# Altium schematic sheet PSU.SchDoc
size A
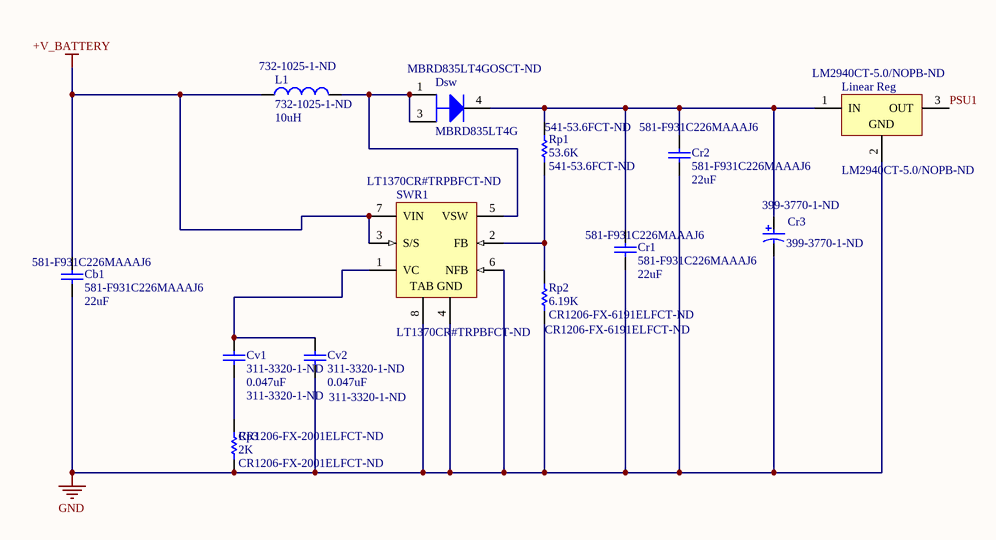
[diagram p0: PSU.SchDoc]

## Parts
Cb1  581-F931C226MAAAJ6  value 22uF  [C1206]
Cr1  581-F931C226MAAAJ6  value 22uF  [C1206]
Cr2  581-F931C226MAAAJ6  value 22uF  [C1206]
Cr3  399-3770-1-ND  [KEMT-T491-D_L]
Cv1  311-3320-1-ND  value 0.047uF  [C1206]
Cv2  311-3320-1-ND  value 0.047uF  [C1206]
Dsw  MBRD835LT4G  Supplier Part Number 1: MBRD835LT4GOSCT-ND  [ONSC-DPAK-3-369C-01_V]
L1  732-1025-1-ND  value 10uH  [2029]
Linear_Reg  LM2940CT-5.0/NOPB-ND  [NDE0003A]
Rp1  541-53.6FCT-ND  value 53.6K  [C1206]
Rp2  CR1206-FX-6191ELFCT-ND  value 6.19K  [C1206]
Rp3  CR1206-FX-2001ELFCT-ND  value 2K  [C1206]
SWR1  LT1370CR#TRPBFCT-ND  [LT-R-7_L]

## Nets
+V_BATTERY: Cb1.2 L1.1 SWR1.3(S/S) SWR1.7(VIN)
GND: Cb1.1 Cr1.1 Cr2.1 Cr3.2 Cv2.2 Linear_Reg.2(GND) Rp2.1 Rp3.1 SWR1.4(GND) SWR1.6(NFB) SWR1.8(TAB)
PSU1: Linear_Reg.3(OUT)
NetCr1_2: Cr1.2 Cr2.2 Cr3.1 Dsw.4(K) Linear_Reg.1(IN) Rp1.2
NetCv1_1: Cv1.1 Cv2.1 SWR1.1(VC)
NetCv1_2: Cv1.2 Rp3.2
NetDsw_1: Dsw.1(A) Dsw.3(A) L1.2 SWR1.5(VSW)
NetRp1_1: Rp1.1 Rp2.2 SWR1.2(FB)

## Library data of the parts
Cb1 Cr1 Cr2 = Cap: Cap Tant Solid 22uF 16V A CASE 20% (3.2 X 1.6 X 1.6mm) Inward L SMD 3216-18 3 Ohm 125C Automotive T/R, Mouser; Manufacturer: Kyocera AVX; Published: 8-Jun-2000; LatestRevisionDate: 17-Jul-2002; LatestRevisionNote: Re-released for DXP Platform.; PackageReference: RAD-0.3; Publisher: Altium Limited; PackageDescription: Radial Cap, Thru-Hole; 2 Leads; 0.3 in Pin Spacing; Supplier 1: Mouser; Supplier Part Number 1: 581-F931C226MAAAJ6; Manufacturer Part Number: F931C226MAAAJ6; RoHS: No; Stock 1: 5204; Pricing 1: 1=0.64000, 10=0.45200, 100=0.28600, 500=0.22000, 1000=0.18700, 2000=0.14300 (USD)
Cr3 = CMP-2000-07541-1: Tantalum Surface Mount Capacitor, 100 uF, +/- 10%, 16 V, -55 to 125 degC, 2917 (7343 Metric), RoHS, Tape and Reel, Digi-key; Manufacturer: Kemet; Manufacturer Part Number: T491D107K016AT; ESR (Equivalent Series Resistance): 700mOhm; Dissipation Factor: 8%; Voltage Rating (DC): 16V; Case\/Package: Molded; Polarity: Polar; Capacitance: 100uF; Life (Hours): 2000Hour; Leakage Current: 16uA; Ripple Current: 463mA; RoHSCompliant: true; Datasheet Version: 07/2017; Case Code (Imperial): 2917; Width: 4.3mm; Height: 2.8mm; Min Operating Temperature: -55degC; Length: 7.3mm; Package Reference: T491-D; Dielectric Material: Tantalum; Packaging: TapeandReel; Max Operating Temperature: 125degC; Package Description: 2-Pin Surface Mount Device, Body 7.3 x 4.3 mm; Package Quantity: 1; Lead Free: LeadFree; Case Code (Metric): 7343; Voltage: 16V; Voltage Rating: 16V; Tolerance: 10%; Weight: 0.023634oz; Termination: SMD/SMT; Lead Pitch: 3.6mm; Manufacturer URL: http://www.kemet.com/; Datasheet URL: http://www.kemet.com/Lists/ProductCatalog/Attachments/254/KEM_T2005_T491.pdf; Radiation Hardening: No; Mount: PCB; Height - Seated (Max): 0.122inch; Mounting Technology: SurfaceMount; Depth: 4.3mm; REACH SVHC: NoSVHC; Supplier 1: Digi-Key; Supplier Part Number 1: 399-3770-1-ND; RoHS: Yes; Category: Tantalum Capacitors; Stock 1: 119781; Pricing 1: 1=1.30000, 10=1.02600, 100=0.76930 (USD); Case/Package: Molded; Features: General Purpose; ComponentLink1URL: https://datasheet.ciiva.com/20171/458379-da-en-01-20171921.pdf?src-supplier=Rapid+Electronics; ComponentLink1Description: https://datasheet.ciiva.com/20171/458379-da-en-01-20171921.pdf?src-supplier=Rapid+Electronics; ComponentLink2URL: https://datasheet.ciiva.com/27052/1574225-27052588.pdf?src-supplier=Jameco; ComponentLink2Description: https://datasheet.ciiva.com/27052/1574225-27052588.pdf?src-supplier=Jameco; ComponentLink3URL: https://datasheet.ciiva.com/5934/1732757-5934631.pdf?src-supplier=Farnell; ComponentLink3Description: https://datasheet.ciiva.com/5934/1732757-5934631.pdf?src-supplier=Farnell; ComponentLink4URL: https://datasheet.ciiva.com/26341/458379-da-01-en-kondensator-100uf-7343-10pr-16v-85c-26341618.pdf?src-supplier=Conrad; ComponentLink4Description: https://datasheet.ciiva.com/26341/458379-da-01-en-kondensator-100uf-7343-10pr-16v-85c-26341618.pdf?src-supplier=Conrad; ComponentLink5URL: https://datasheet.ciiva.com/260/kem-t2005-t491-260262.pdf?src-supplier=Digi-Key; ComponentLink5Description: https://datasheet.ciiva.com/260/kem-t2005-t491-260262.pdf?src-supplier=Digi-Key; ComponentLink6URL: https://datasheet.ciiva.com/260/kem-t2005-t491-260263.pdf?src-supplier=Digi-Key; ComponentLink6Description: https://datasheet.ciiva.com/260/kem-t2005-t491-260263.pdf?src-supplier=Digi-Key; ComponentLink7URL: https://datasheet.ciiva.com/41657/1854511-41657335.pdf?src-supplier=Farnell; ComponentLink7Description: https://datasheet.ciiva.com/41657/1854511-41657335.pdf?src-supplier=Farnell; ComponentLink8URL: https://datasheet.ciiva.com/260/kem-t2005-t491-260264.pdf?src-supplier=Digi-Key; ComponentLink8Description: https://datasheet.ciiva.com/260/kem-t2005-t491-260264.pdf?src-supplier=Digi-Key; ComponentLink9URL: https://datasheet.ciiva.com/14595/70095774-14595116.pdf?src-supplier=Allied+Electronics; ComponentLink9Description: https://datasheet.ciiva.com/14595/70095774-14595116.pdf?src-supplier=Allied+Electronics; ComponentLink10URL: https://datasheet.ciiva.com/7696/1854511-7696350.pdf?src-supplier=Element14; ComponentLink10Description: https://datasheet.ciiva.com/7696/1854511-7696350.pdf?src-supplier=Element14; ComponentLink11URL: https://datasheet.ciiva.com/14588/70095774-14588350.pdf?src-supplier=Allied+Electronics; ComponentLink11Description: https://datasheet.ciiva.com/14588/70095774-14588350.pdf?src-supplier=Allied+Electronics; ComponentLink12URL: https://datasheet.ciiva.com/7696/1854511-7696351.pdf?src-supplier=Element14; ComponentLink12Description: https://datasheet.ciiva.com/7696/1854511-7696351.pdf?src-supplier=Element14
Cv1 Cv2 = Cap: CAP CER 0.47UF 4V X5R 0201, Digi-key; Manufacturer: Yageo; Manufacturer Part Number: CC0201MRX5R4BB474; Capacitance: 470nF; Tolerance: 20%; Published: 8-Jun-2000; LatestRevisionDate: 17-Jul-2002; LatestRevisionNote: Re-released for DXP Platform.; PackageReference: RAD-0.3; Publisher: Altium Limited; PackageDescription: Radial Cap, Thru-Hole; 2 Leads; 0.3 in Pin Spacing; Supplier 1: Digi-Key; Supplier Part Number 1: 311-3320-1-ND; RoHS: Yes; Category: Ceramic Capacitors; Stock 1: 31395; Pricing 1: 1=0.10000, 10=0.07100, 100=0.03150, 500=0.02252, 1000=0.01770, 2500=0.01609, 5000=0.01480 (USD); Mount: Surface Mount; Case/Package: 0201; Min Operating Temperature: -55°C; Max Operating Temperature: 85°C; Packaging: Tape and Reel; Voltage Rating: 4V; Length: 0.024inch; Width: 0.012inch; Thickness: 0.013inch; ComponentLink1URL: http://www.yageo.com/documents/recent/UPY-GPHC_X5R_4V-to-50V_23.pdf?src-supplier=Digi-Key; ComponentLink1Description: http://www.yageo.com/documents/recent/UPY-GPHC_X5R_4V-to-50V_23.pdf?src-supplier=Digi-Key; ComponentLink2URL: http://www.yageo.com/documents/recent/UPY-GPHC_X5R_4V-to-50V_25.pdf?src-supplier=Digi-Key; ComponentLink2Description: http://www.yageo.com/documents/recent/UPY-GPHC_X5R_4V-to-50V_25.pdf?src-supplier=Digi-Key
Dsw = CMP-1055-00173-1: SWITCHMODE(TM) Power Rectifier, 3-Pin DPAK, Pb-Free, Tape and Reel, Digi-key; Manufacturer: On Semiconductor; IFSM Max (A): 75; Configuration: Single; ComponentLink3URL: http://www.onsemi.cn/pub_link/Collateral/369C.PDF; ComponentLink2URL: http://www.onsemi.cn/pub_link/Collateral/MBRD835L-D.PDF; RoHS: TRUE; PackageVersion: Rev. E, 02/2014; Mounting Technology: Surface Mount; PackageDescription: 3-Pin Flange Mount, Body 6.54 x 6.095 mm, Pitch 2.29 mm; PartNumber: MBRD835LT4G; ComponentLink1URL: http://www.onsemi.com/; PackageReference: DPAK-3-369C-01; Packing: Tape and Reel; ComponentLink1Description: Manufacturer URL; ComponentLink2Description: Datasheet; DatasheetVersion: Rev. 11; ComponentLink3Description: Package Specification; Supplier 1: Digi-Key
L1 = Inductor: Inductor, SMD 10 uH 1.3 A ±30%, 744042100, Würth Elektronik, Digi-key; Manufacturer: Wurth Electronics; Code_IEC: 1005; Core Material: Ferrite; DC Resistance (DCR): 150mR; Max DC Current: 1.3A; Self Resonant Frequency: 45MHz; Shielding: Shielded; Test Frequency: 100kHz; Saturation Current: 1A; Published: 8-Jun-2000; LatestRevisionDate: 29-May-2009; LatestRevisionNote: IPC-7351 Footprint Added.; PackageReference: 0402-A; Publisher: Altium Limited; PackageDescription: Chip Inductor; Code_JEITA: 0402; Supplier 1: Digi-Key; Supplier Part Number 1: 732-1025-1-ND; Manufacturer Part Number: 744042100; RoHS: Yes; Category: Fixed Inductors; Stock 1: 16164; Pricing 1: 1=1.43000, 10=1.38900, 50=1.21500, 100=1.11100 (USD); Mount: Surface Mount; Case/Package: 1919; Number of Pins: 2; Weight: 0.00582oz; Case Code (Imperial): 1919; Case Code (Metric): 4848; Min Operating Temperature: -40°C; Max Operating Temperature: 125°C; Termination: SMD/SMT; Packaging: Tape and Reel; Inductance: 10uH; Tolerance: 30%; Package Quantity: 800; Inductance Tolerance: 30%; Current Rating: 1.3A; RMS Current (Irms): 1.3A; Composition: Wirewound; Series Resistance: 150mR; Length: 4.8mm; Height: 1.8mm; Width: 4.8mm; Depth: 4.8mm; Height - Seated (Max): 0.079inch; REACH SVHC: Unknown; Lead Free: Lead Free; ComponentLink1URL: https://datasheet.ciiva.com/13320/744042100-88981-13320858.pdf?src-supplier=Mouser; ComponentLink1Description: https://datasheet.ciiva.com/13320/744042100-88981-13320858.pdf?src-supplier=Mouser; ComponentLink2URL: https://datasheet.ciiva.com/11800/0900766b8079f7c1-11800146.pdf?src-supplier=RSComponents; ComponentLink2Description: https://datasheet.ciiva.com/11800/0900766b8079f7c1-11800146.pdf?src-supplier=RSComponents; ComponentLink3URL: https://datasheet.ciiva.com/22702/744042100-22702643.pdf?src-supplier=Element14; ComponentLink3Description: https://datasheet.ciiva.com/22702/744042100-22702643.pdf?src-supplier=Element14; ComponentLink4URL: https://datasheet.ciiva.com/1050/744042100-1050948.pdf?src-supplier=Digi-Key; ComponentLink4Description: https://datasheet.ciiva.com/1050/744042100-1050948.pdf?src-supplier=Digi-Key; ComponentLink5URL: https://datasheet.ciiva.com/1050/744042100-1050950.pdf?src-supplier=Digi-Key; ComponentLink5Description: https://datasheet.ciiva.com/1050/744042100-1050950.pdf?src-supplier=Digi-Key; ComponentLink6URL: https://datasheet.ciiva.com/1050/744042100-1050949.pdf?src-supplier=Digi-Key; ComponentLink6Description: https://datasheet.ciiva.com/1050/744042100-1050949.pdf?src-supplier=Digi-Key; ComponentLink7URL: https://datasheet.ciiva.com/7754/744042100-7754411.pdf?src-supplier=Element14; ComponentLink7Description: https://datasheet.ciiva.com/7754/744042100-7754411.pdf?src-supplier=Element14
Linear_Reg = CMP-0062-02545-3: 1A Low Dropout Regulator, 3-pin TO-220, Pb-Free, Digi-key; Manufacturer: Texas Instruments; CompType: LDO IC; PowerWise: N; PackageTopMarking: NSUZXYTTE#*LM2940CT*-5.0 P+; RoHS: Y; ComponentLink1URL: http://www.ti.com/general/docs/lit/getliterature.tsp?genericPartNumber=LM2940C&fileType=pdf; PinCount: 3; ComponentLink1Description: Datasheet URL; PackageReference: NDE0003A; PackageDescription: TO-220, Molded, 3 Lead, Straight; Supplier 1: Digi-Key; Supplier Part Number 1: LM2940CT-5.0/NOPB-ND
Rp1 = Res1: Res Thick Film 1206 53.6 Ohm 1% 0.25W(1/4W) ±100ppm/C Molded SMD Automotive Paper T/R, Digi-key; Manufacturer: Vishay; Manufacturer Part Number: CRCW120653R6FKEA; Resistance: 53.6R; Power Rating: 250mW; Voltage Rating (DC): 200V; Temperature Coefficient: 100ppm/°C; Published: 8-Jun-2000; LatestRevisionDate: 17-Jul-2002; LatestRevisionNote: Re-released for DXP Platform.; PackageReference: AXIAL-0.3; Publisher: Altium Limited; PackageDescription: Axial Device, Thru-Hole; 2 Leads; 0.3 in Pin Spacing; Supplier 1: Digi-Key; Supplier Part Number 1: 541-53.6FCT-ND; RoHS: Yes; Category: Chip SMD Resistors; Stock 1: 787; Pricing 1: 1=0.10000, 10=0.07600, 100=0.02930, 1000=0.01287, 2500=0.01112 (USD); Case/Package: 1206; Number of Pins: 2; Weight: 0.000353oz; Contact Plating: Tin; Case Code (Metric): 3216; Case Code (Imperial): 1206; Min Operating Temperature: -55°C; Max Operating Temperature: 155°C; Package Quantity: 10; Packaging: Tape and Reel; Termination: SMD/SMT; Tolerance: 1%; Number of Terminations: 2; Voltage Rating: 200V; Composition: Thick Film; Max Power Dissipation: 250mW; Military Standard: Not; Features: Automotive AEC-Q200; Length: 3.2mm; Height: 0.024inch; Depth: 1.6mm; Width: 0.063inch; Radiation Hardening: No; REACH SVHC: Unknown; Lead Free: Lead Free; ComponentLink1URL: https://datasheet.ciiva.com/2497/dcrcwe3-2497248.pdf?src-supplier=Digi-Key; ComponentLink1Description: https://datasheet.ciiva.com/2497/dcrcwe3-2497248.pdf?src-supplier=Digi-Key; ComponentLink2URL: https://datasheet.ciiva.com/9000/dcrcwe3-9000149.pdf?src-supplier=Avnet; ComponentLink2Description: https://datasheet.ciiva.com/9000/dcrcwe3-9000149.pdf?src-supplier=Avnet; ComponentLink3URL: https://datasheet.ciiva.com/5543/dcrcwe3-109170-5543196.pdf?src-supplier=Mouser; ComponentLink3Description: https://datasheet.ciiva.com/5543/dcrcwe3-109170-5543196.pdf?src-supplier=Mouser; ComponentLink4URL: https://datasheet.ciiva.com/22699/1697337-22699228.pdf?src-supplier=Element14; ComponentLink4Description: https://datasheet.ciiva.com/22699/1697337-22699228.pdf?src-supplier=Element14; ComponentLink5URL: https://datasheet.ciiva.com/7732/1697337-7732205.pdf?src-supplier=Element14; ComponentLink5Description: https://datasheet.ciiva.com/7732/1697337-7732205.pdf?src-supplier=Element14; ComponentLink6URL: https://datasheet.ciiva.com/2497/dcrcwe3-2497246.pdf?src-supplier=Digi-Key; ComponentLink6Description: https://datasheet.ciiva.com/2497/dcrcwe3-2497246.pdf?src-supplier=Digi-Key; ComponentLink7URL: https://datasheet.ciiva.com/7732/1697337-7732206.pdf?src-supplier=Element14; ComponentLink7Description: https://datasheet.ciiva.com/7732/1697337-7732206.pdf?src-supplier=Element14; ComponentLink8URL: https://datasheet.ciiva.com/2497/dcrcwe3-2497247.pdf?src-supplier=Digi-Key; ComponentLink8Description: https://datasheet.ciiva.com/2497/dcrcwe3-2497247.pdf?src-supplier=Digi-Key
Rp2 = Res1: Thick Film Resistors 6.19K 1%,Digi-key; Manufacturer: Bourns; Max Power Dissipation: 250mW; Temperature Coefficient: 100ppm/°C; Resistance: 6.19kR; Voltage Rating: 200V; Published: 8-Jun-2000; LatestRevisionDate: 17-Jul-2002; LatestRevisionNote: Re-released for DXP Platform.; PackageReference: AXIAL-0.3; Publisher: Altium Limited; PackageDescription: Axial Device, Thru-Hole; 2 Leads; 0.3 in Pin Spacing; Supplier 1: Digi-Key; Supplier Part Number 1: CR1206-FX-6191ELFCT-ND; Manufacturer Part Number: CR1206-FX-6191ELF; RoHS: Yes; Category: Chip SMD Resistors; Stock 1: 19832; Pricing 1: 1=0.11000, 10=0.09400, 100=0.03630, 1000=0.01597, 2500=0.01380 (USD); Mount: Surface Mount; Case/Package: 1206; Contact Plating: Tin; Case Code (Imperial): 1206; Case Code (Metric): 3216; Min Operating Temperature: -55°C; Max Operating Temperature: 155°C; Termination: SMD/SMT; Number of Terminations: 2; Military Standard: Not; Composition: Thick Film; Tolerance: 1%; Power Rating: 250mW; Packaging: Tape and Reel; Package Quantity: 5000; Length: 3.2mm; Height: 0.03inch; Depth: 1.6mm; Width: 1.6mm; Thickness: 610um; Radiation Hardening: No; ComponentLink1URL: https://datasheet.ciiva.com/5542/chpreztr-5542280.pdf?src-supplier=Mouser; ComponentLink1Description: https://datasheet.ciiva.com/5542/chpreztr-5542280.pdf?src-supplier=Mouser; ComponentLink2URL: https://datasheet.ciiva.com/9122/chpreztr-9122638.pdf?src-supplier=Avnet; ComponentLink2Description: https://datasheet.ciiva.com/9122/chpreztr-9122638.pdf?src-supplier=Avnet
Rp3 = Res1: BOURNS - CR1206-FX-2001ELF - RES, 2K, 1%, 0.25W, 1206, THICK FILM, Digi-key; Temperature Coefficient: 100ppm/°C; Resistance: 2kR; Power Rating: 250mW; Voltage Rating: 200V; Published: 8-Jun-2000; LatestRevisionDate: 17-Jul-2002; LatestRevisionNote: Re-released for DXP Platform.; PackageReference: AXIAL-0.3; Publisher: Altium Limited; PackageDescription: Axial Device, Thru-Hole; 2 Leads; 0.3 in Pin Spacing; Supplier 1: Digi-Key; Supplier Part Number 1: CR1206-FX-2001ELFCT-ND; Manufacturer: Bourns; Manufacturer Part Number: CR1206-FX-2001ELF; RoHS: Yes; Category: Chip SMD Resistors; Stock 1: 36084; Pricing 1: 1=0.10000, 10=0.03800, 100=0.01560, 1000=0.00700, 2500=0.00607 (USD); Mount: Surface Mount; Case/Package: 1206; Number of Pins: 2; Contact Plating: Tin; Case Code (Metric): 3216; Case Code (Imperial): 1206; Min Operating Temperature: -55°C; Max Operating Temperature: 155°C; Number of Terminations: 2; Termination: SMD/SMT; Military Standard: Not; Composition: Thick Film; Tolerance: 1%; Packaging: Tape and Reel; Package Quantity: 1; Features: Moisture Resistant; Voltage Rating (DC): 200V; Max Power Dissipation: 250mW; Length: 3.2mm; Height: 0.03inch; Depth: 1.6mm; Width: 1.6mm; Thickness: 610um; Radiation Hardening: No; REACH SVHC: No SVHC; ComponentLink1URL: https://datasheet.ciiva.com/9123/chpreztr-9123286.pdf?src-supplier=Avnet; ComponentLink1Description: https://datasheet.ciiva.com/9123/chpreztr-9123286.pdf?src-supplier=Avnet; ComponentLink2URL: https://datasheet.ciiva.com/6547/chpreztr-6547512.pdf?src-supplier=Digi-Key; ComponentLink2Description: https://datasheet.ciiva.com/6547/chpreztr-6547512.pdf?src-supplier=Digi-Key; ComponentLink3URL: https://datasheet.ciiva.com/6547/chpreztr-6547518.pdf?src-supplier=Digi-Key; ComponentLink3Description: https://datasheet.ciiva.com/6547/chpreztr-6547518.pdf?src-supplier=Digi-Key; ComponentLink4URL: https://datasheet.ciiva.com/46383/691949-46383774.pdf?src-supplier=Element14; ComponentLink4Description: https://datasheet.ciiva.com/46383/691949-46383774.pdf?src-supplier=Element14; ComponentLink5URL: https://datasheet.ciiva.com/22713/691949-22713279.pdf?src-supplier=Element14; ComponentLink5Description: https://datasheet.ciiva.com/22713/691949-22713279.pdf?src-supplier=Element14; ComponentLink6URL: https://datasheet.ciiva.com/5543/chpreztr-5543718.pdf?src-supplier=Mouser; ComponentLink6Description: https://datasheet.ciiva.com/5543/chpreztr-5543718.pdf?src-supplier=Mouser; ComponentLink7URL: https://datasheet.ciiva.com/16927/chpreztr-16927448.pdf?src-supplier=Avnet+Europe; ComponentLink7Description: https://datasheet.ciiva.com/16927/chpreztr-16927448.pdf?src-supplier=Avnet+Europe; ComponentLink8URL: https://datasheet.ciiva.com/6547/chpreztr-6547515.pdf?src-supplier=Digi-Key; ComponentLink8Description: https://datasheet.ciiva.com/6547/chpreztr-6547515.pdf?src-supplier=Digi-Key; ComponentLink9URL: https://datasheet.ciiva.com/48692/001055531-da-01-en-smd-wid-cr1206-fx-2001elf-2k-ohm-1-4w-48692026.pdf?src-supplier=Conrad; ComponentLink9Description: https://datasheet.ciiva.com/48692/001055531-da-01-en-smd-wid-cr1206-fx-2001elf-2k-ohm-1-4w-48692026.pdf?src-supplier=Conrad
SWR1 = CMP-0491-01356-1: 500 kHz High Efficiency 6 A Switching Regulator, 7-pin DPAK (R-7), 0 to 125 degC, Digi-key; Manufacturer: Linear Technology; Frequency Sync Range: 600kHz - 800kHz; Number of Outputs: 1; ComponentLink3URL: http://cds.linear.com/docs/en/packaging/05081462_F_R.pdf; ComponentLink3Description: Package Specification; RoHS: FALSE; PackageReference: R-7; ComponentLink2URL: http://cds.linear.com/docs/en/datasheet/1370fs.pdf; Mounting Technology: Surface Mount; ComponentLink1Description: Manufacturer URL; ComponentLink2Description: Datasheet; ComponentLink1URL: http://www.linear.com/; PackageDescription: 7-Pin Plastic DD Pak, Body 10.2235 x 8.89 mm, Pitch 1.27 mm; PackageVersion: Rev. F, 05/2012; PartNumber: LT1370CR; Supplier 1: Digi-Key; Supplier Part Number 1: LT1370CR#TRPBFCT-ND